# EAGLE schematic line-sensor-var1-r1-2018-10-02 (EAGLE 9.1.3)

## Sheet 1 of 2
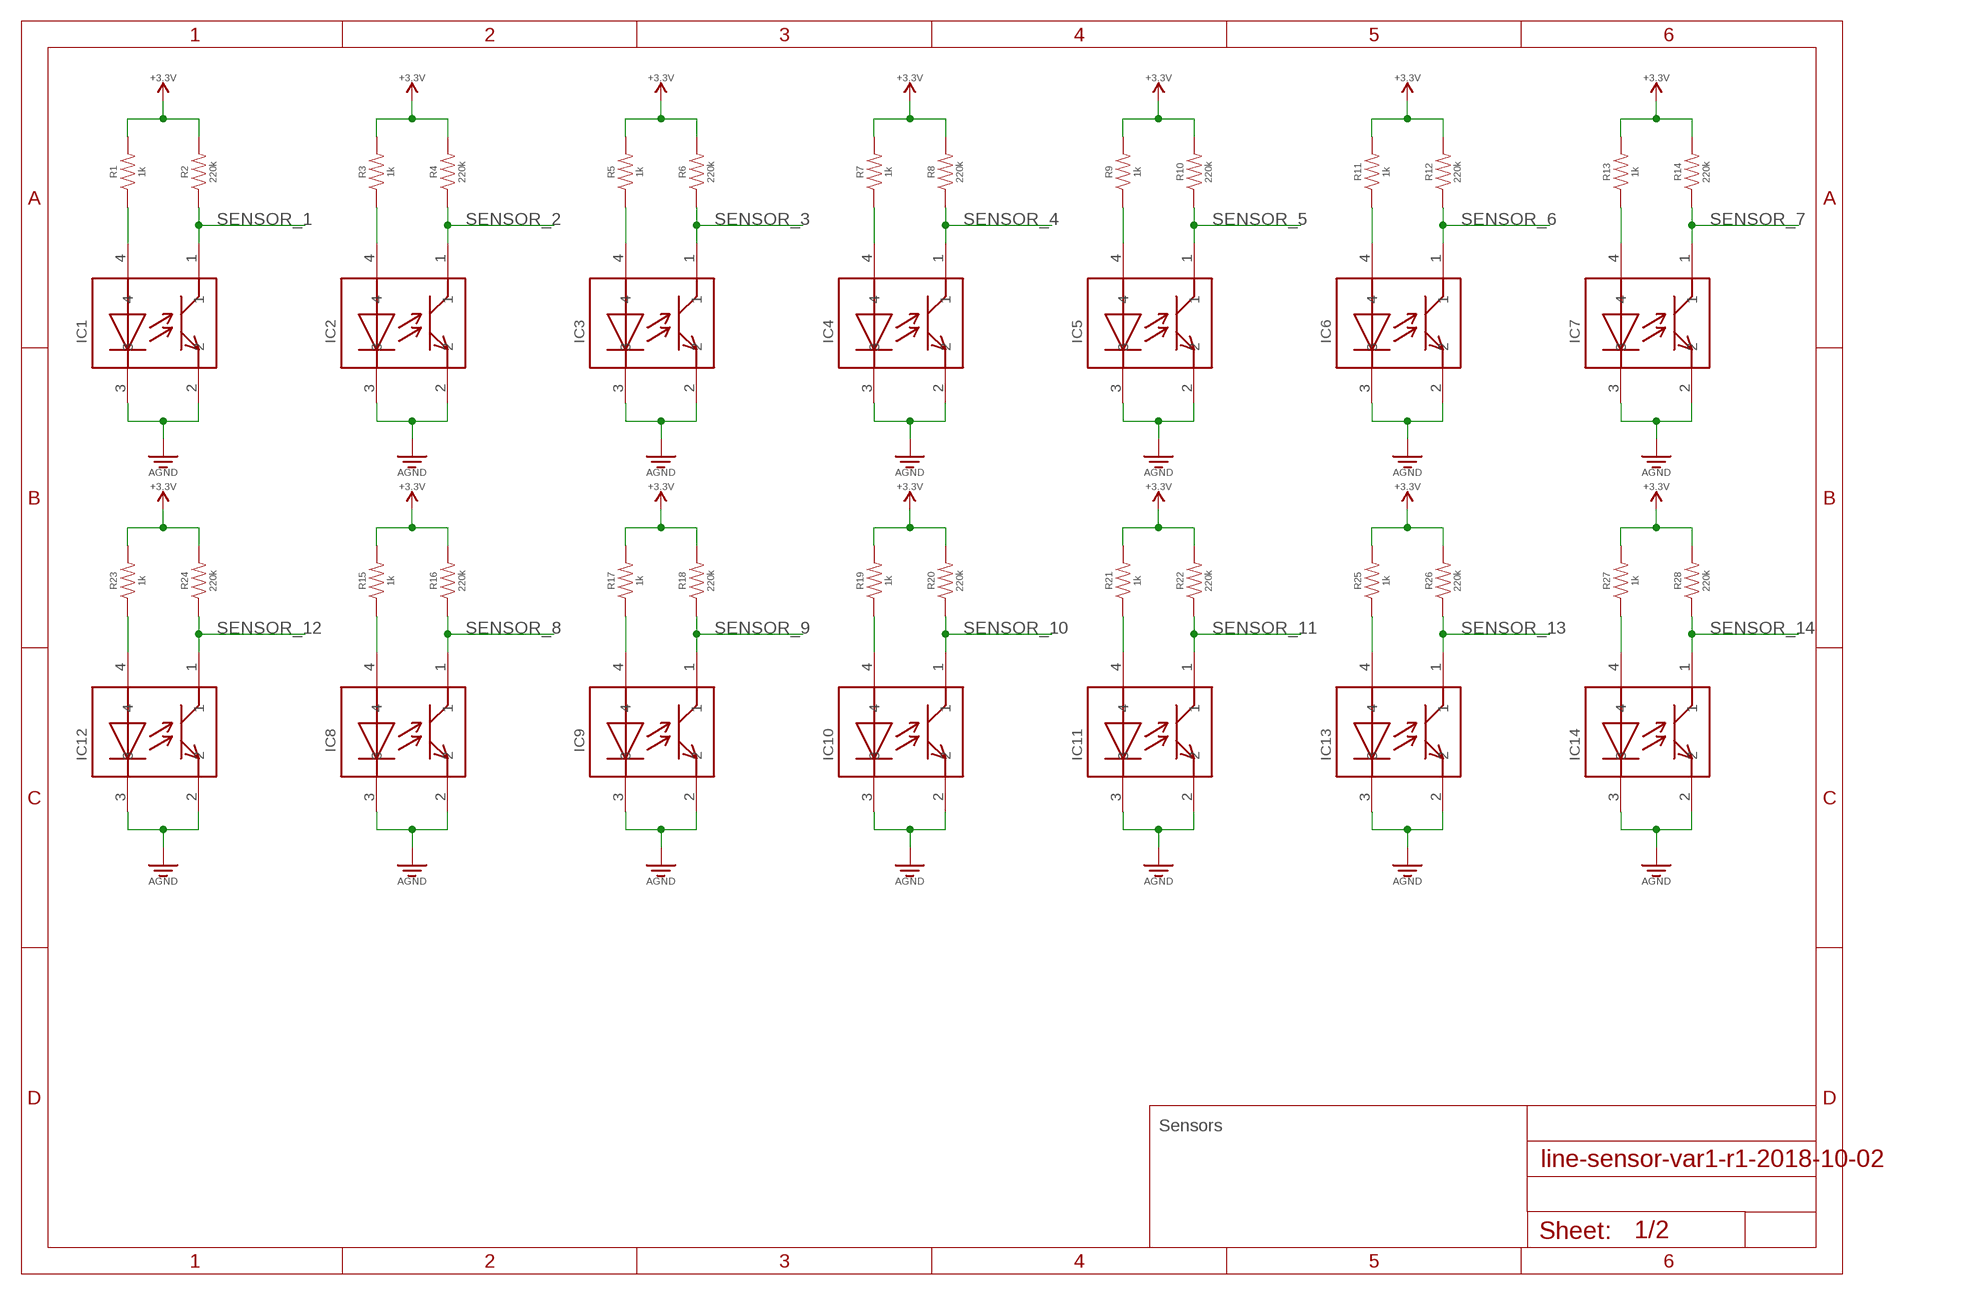
[diagram p0: schematic, sheet 1]

### Parts
IC1  GP2S60  [GP2S60]
IC2  GP2S60  [GP2S60]
IC3  GP2S60  [GP2S60]
IC4  GP2S60  [GP2S60]
IC5  GP2S60  [GP2S60]
IC6  GP2S60  [GP2S60]
IC7  GP2S60  [GP2S60]
IC8  GP2S60  [GP2S60]
IC9  GP2S60  [GP2S60]
IC10  GP2S60  [GP2S60]
IC11  GP2S60  [GP2S60]
IC12  GP2S60  [GP2S60]
IC13  GP2S60  [GP2S60]
IC14  GP2S60  [GP2S60]
R1  1k  RESISTOR_0.1W  [RESISTOR-0603]
R2  220k  RESISTOR_0.1W  [RESISTOR-0603]
R3  1k  RESISTOR_0.1W  [RESISTOR-0603]
R4  220k  RESISTOR_0.1W  [RESISTOR-0603]
R5  1k  RESISTOR_0.1W  [RESISTOR-0603]
R6  220k  RESISTOR_0.1W  [RESISTOR-0603]
R7  1k  RESISTOR_0.1W  [RESISTOR-0603]
R8  220k  RESISTOR_0.1W  [RESISTOR-0603]
R9  1k  RESISTOR_0.1W  [RESISTOR-0603]
R10  220k  RESISTOR_0.1W  [RESISTOR-0603]
R11  1k  RESISTOR_0.1W  [RESISTOR-0603]
R12  220k  RESISTOR_0.1W  [RESISTOR-0603]
R13  1k  RESISTOR_0.1W  [RESISTOR-0603]
R14  220k  RESISTOR_0.1W  [RESISTOR-0603]
R15  1k  RESISTOR_0.1W  [RESISTOR-0603]
R16  220k  RESISTOR_0.1W  [RESISTOR-0603]
R17  1k  RESISTOR_0.1W  [RESISTOR-0603]
R18  220k  RESISTOR_0.1W  [RESISTOR-0603]
R19  1k  RESISTOR_0.1W  [RESISTOR-0603]
R20  220k  RESISTOR_0.1W  [RESISTOR-0603]
R21  1k  RESISTOR_0.1W  [RESISTOR-0603]
R22  220k  RESISTOR_0.1W  [RESISTOR-0603]
R23  1k  RESISTOR_0.1W  [RESISTOR-0603]
R24  220k  RESISTOR_0.1W  [RESISTOR-0603]
R25  1k  RESISTOR_0.1W  [RESISTOR-0603]
R26  220k  RESISTOR_0.1W  [RESISTOR-0603]
R27  1k  RESISTOR_0.1W  [RESISTOR-0603]
R28  220k  RESISTOR_0.1W  [RESISTOR-0603]
SUPPLY1  +3.3V  (no package)
SUPPLY3  +3.3V  (no package)
SUPPLY4  +3.3V  (no package)
SUPPLY5  +3.3V  (no package)
SUPPLY6  +3.3V  (no package)
SUPPLY7  +3.3V  (no package)
SUPPLY8  +3.3V  (no package)
SUPPLY9  +3.3V  (no package)
SUPPLY10  +3.3V  (no package)
SUPPLY11  +3.3V  (no package)
SUPPLY12  +3.3V  (no package)
SUPPLY13  +3.3V  (no package)
SUPPLY14  +3.3V  (no package)
SUPPLY15  +3.3V  (no package)

### Nets
3V3 [3v3]: R1.P$2 R2.P$2 R3.P$2 R4.P$2 R5.P$2 R6.P$2 R7.P$2 R8.P$2 R9.P$2 R10.P$2 R11.P$2 R12.P$2 R13.P$2 R14.P$2 R15.P$2 R16.P$2 R17.P$2 R18.P$2 R19.P$2 R20.P$2 R21.P$2 R22.P$2 R23.P$2 R24.P$2 R25.P$2 R26.P$2 R27.P$2 R28.P$2 SUPPLY1.VCC SUPPLY3.VCC SUPPLY4.VCC SUPPLY5.VCC SUPPLY6.VCC SUPPLY7.VCC SUPPLY8.VCC SUPPLY9.VCC SUPPLY10.VCC SUPPLY11.VCC SUPPLY12.VCC SUPPLY13.VCC SUPPLY14.VCC SUPPLY15.VCC ; also sheet 2
AGND [ground]: IC1.2 IC1.3 IC2.2 IC2.3 IC3.2 IC3.3 IC4.2 IC4.3 IC5.2 IC5.3 IC6.2 IC6.3 IC7.2 IC7.3 IC8.2 IC8.3 IC9.2 IC9.3 IC10.2 IC10.3 IC11.2 IC11.3 IC12.2 IC12.3 IC13.2 IC13.3 IC14.2 IC14.3 ; also sheet 2
N$1: IC2.4 R3.P$1
N$2: IC1.4 R1.P$1
N$3: IC3.4 R5.P$1
N$4: IC4.4 R7.P$1
N$5: IC5.4 R9.P$1
N$6: IC6.4 R11.P$1
N$7: IC7.4 R13.P$1
N$8: IC8.4 R15.P$1
N$9: IC9.4 R17.P$1
N$10: IC10.4 R19.P$1
N$11: IC11.4 R21.P$1
N$12: IC12.4 R23.P$1
N$13: IC13.4 R25.P$1
N$14: IC14.4 R27.P$1
SENSOR_1: IC1.1 R2.P$1 ; also sheet 2
SENSOR_2: IC2.1 R4.P$1 ; also sheet 2
SENSOR_3: IC3.1 R6.P$1 ; also sheet 2
SENSOR_4: IC4.1 R8.P$1 ; also sheet 2
SENSOR_5: IC5.1 R10.P$1 ; also sheet 2
SENSOR_6: IC6.1 R12.P$1 ; also sheet 2
SENSOR_7: IC7.1 R14.P$1 ; also sheet 2
SENSOR_8: IC8.1 R16.P$1 ; also sheet 2
SENSOR_9: IC9.1 R18.P$1 ; also sheet 2
SENSOR_10: IC10.1 R20.P$1 ; also sheet 2
SENSOR_11: IC11.1 R22.P$1 ; also sheet 2
SENSOR_12: IC12.1 R24.P$1 ; also sheet 2
SENSOR_13: IC13.1 R26.P$1 ; also sheet 2
SENSOR_14: IC14.1 R28.P$1 ; also sheet 2

### Notes on the sheet
- Sensors

## Sheet 2 of 2
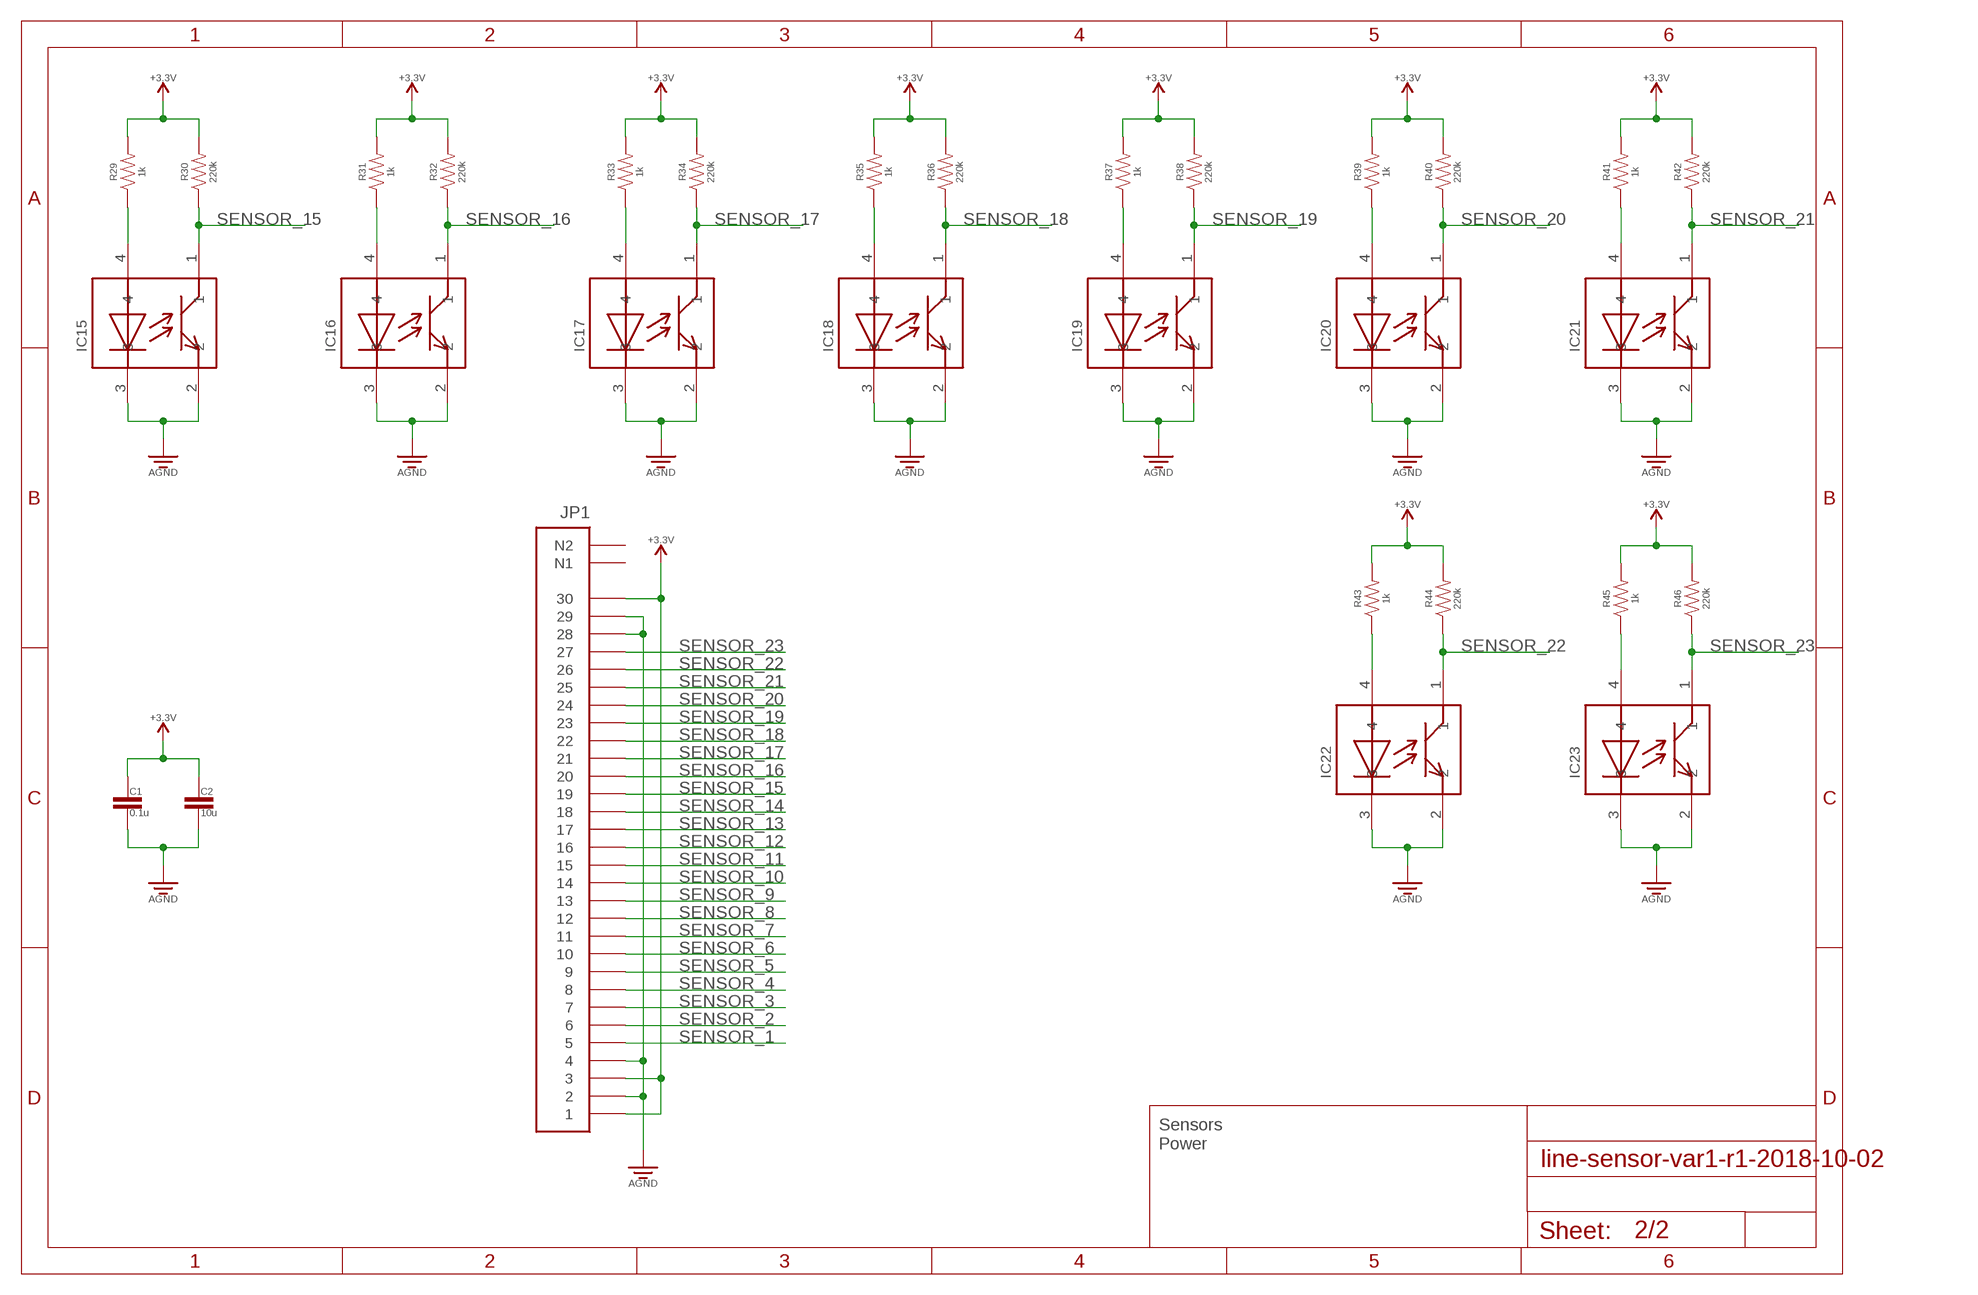
[diagram p1: schematic, sheet 2]

### Parts
C1  0.1u  CAPACITOR0603  [CAPACITOR-0603]
C2  10u  CAPACITOR0603  [CAPACITOR-0603]
IC15  GP2S60  [GP2S60]
IC16  GP2S60  [GP2S60]
IC17  GP2S60  [GP2S60]
IC18  GP2S60  [GP2S60]
IC19  GP2S60  [GP2S60]
IC20  GP2S60  [GP2S60]
IC21  GP2S60  [GP2S60]
IC22  GP2S60  [GP2S60]
IC23  GP2S60  [GP2S60]
JP1  MOLEX-502046-3070  [MOLEX-502046-3070]
R29  1k  RESISTOR_0.1W  [RESISTOR-0603]
R30  220k  RESISTOR_0.1W  [RESISTOR-0603]
R31  1k  RESISTOR_0.1W  [RESISTOR-0603]
R32  220k  RESISTOR_0.1W  [RESISTOR-0603]
R33  1k  RESISTOR_0.1W  [RESISTOR-0603]
R34  220k  RESISTOR_0.1W  [RESISTOR-0603]
R35  1k  RESISTOR_0.1W  [RESISTOR-0603]
R36  220k  RESISTOR_0.1W  [RESISTOR-0603]
R37  1k  RESISTOR_0.1W  [RESISTOR-0603]
R38  220k  RESISTOR_0.1W  [RESISTOR-0603]
R39  1k  RESISTOR_0.1W  [RESISTOR-0603]
R40  220k  RESISTOR_0.1W  [RESISTOR-0603]
R41  1k  RESISTOR_0.1W  [RESISTOR-0603]
R42  220k  RESISTOR_0.1W  [RESISTOR-0603]
R43  1k  RESISTOR_0.1W  [RESISTOR-0603]
R44  220k  RESISTOR_0.1W  [RESISTOR-0603]
R45  1k  RESISTOR_0.1W  [RESISTOR-0603]
R46  220k  RESISTOR_0.1W  [RESISTOR-0603]
SUPPLY2  +3.3V  (no package)
SUPPLY16  +3.3V  (no package)
SUPPLY17  +3.3V  (no package)
SUPPLY18  +3.3V  (no package)
SUPPLY19  +3.3V  (no package)
SUPPLY20  +3.3V  (no package)
SUPPLY21  +3.3V  (no package)
SUPPLY22  +3.3V  (no package)
SUPPLY23  +3.3V  (no package)
SUPPLY24  +3.3V  (no package)
SUPPLY25  +3.3V  (no package)

### Nets
3V3 [3v3]: C1.1 C2.1 JP1.1 JP1.3 JP1.30 R29.P$2 R30.P$2 R31.P$2 R32.P$2 R33.P$2 R34.P$2 R35.P$2 R36.P$2 R37.P$2 R38.P$2 R39.P$2 R40.P$2 R41.P$2 R42.P$2 R43.P$2 R44.P$2 R45.P$2 R46.P$2 SUPPLY2.VCC SUPPLY16.VCC SUPPLY17.VCC SUPPLY18.VCC SUPPLY19.VCC SUPPLY20.VCC SUPPLY21.VCC SUPPLY22.VCC SUPPLY23.VCC SUPPLY24.VCC SUPPLY25.VCC ; also sheet 1
AGND [ground]: C1.2 C2.2 IC15.2 IC15.3 IC16.2 IC16.3 IC17.2 IC17.3 IC18.2 IC18.3 IC19.2 IC19.3 IC20.2 IC20.3 IC21.2 IC21.3 IC22.2 IC22.3 IC23.2 IC23.3 JP1.2 JP1.4 JP1.28 JP1.29 ; also sheet 1
N$15: IC15.4 R29.P$1
N$16: IC16.4 R31.P$1
N$17: IC17.4 R33.P$1
N$18: IC18.4 R35.P$1
N$19: IC19.4 R37.P$1
N$20: IC20.4 R39.P$1
N$21: IC21.4 R41.P$1
N$22: IC22.4 R43.P$1
N$23: IC23.4 R45.P$1
SENSOR_1: JP1.5 ; also sheet 1
SENSOR_2: JP1.6 ; also sheet 1
SENSOR_3: JP1.7 ; also sheet 1
SENSOR_4: JP1.8 ; also sheet 1
SENSOR_5: JP1.9 ; also sheet 1
SENSOR_6: JP1.10 ; also sheet 1
SENSOR_7: JP1.11 ; also sheet 1
SENSOR_8: JP1.12 ; also sheet 1
SENSOR_9: JP1.13 ; also sheet 1
SENSOR_10: JP1.14 ; also sheet 1
SENSOR_11: JP1.15 ; also sheet 1
SENSOR_12: JP1.16 ; also sheet 1
SENSOR_13: JP1.17 ; also sheet 1
SENSOR_14: JP1.18 ; also sheet 1
SENSOR_15: IC15.1 JP1.19 R30.P$1
SENSOR_16: IC16.1 JP1.20 R32.P$1
SENSOR_17: IC17.1 JP1.21 R34.P$1
SENSOR_18: IC18.1 JP1.22 R36.P$1
SENSOR_19: IC19.1 JP1.23 R38.P$1
SENSOR_20: IC20.1 JP1.24 R40.P$1
SENSOR_21: IC21.1 JP1.25 R42.P$1
SENSOR_22: IC22.1 JP1.26 R44.P$1
SENSOR_23: IC23.1 JP1.27 R46.P$1
Unconnected: JP1.NAIL1(N1) JP1.NAIL2(N2)

### Notes on the sheet
- Sensors
  Power

## Library data of the parts
C1 C2 = capacitors:CAPACITOR
IC1-IC23 = sensors:GP2S60: SMT Compact Reﬂective Photointerrupter Datasheet: http://www.sharp-world.com/products/device/lineup/data/pdf/datasheet/gp2s60_e.pdf
JP1 = connectors:MOLEX-502046-3070
R1-R46 = resistors:RESISTOR_0.1W
SUPPLY1-SUPPLY25 = voltage-ground:+3.3V: +3.3V Voltage Supply Positive voltage supply (traditionally for a BJT device, C=collector).

## Net classes
1 ground: width 0.3 mm
2 3v3: width 0.3 mm